# EAGLE design OSO-SWAT-A1-05-BLUE (EAGLE 9.6.2)
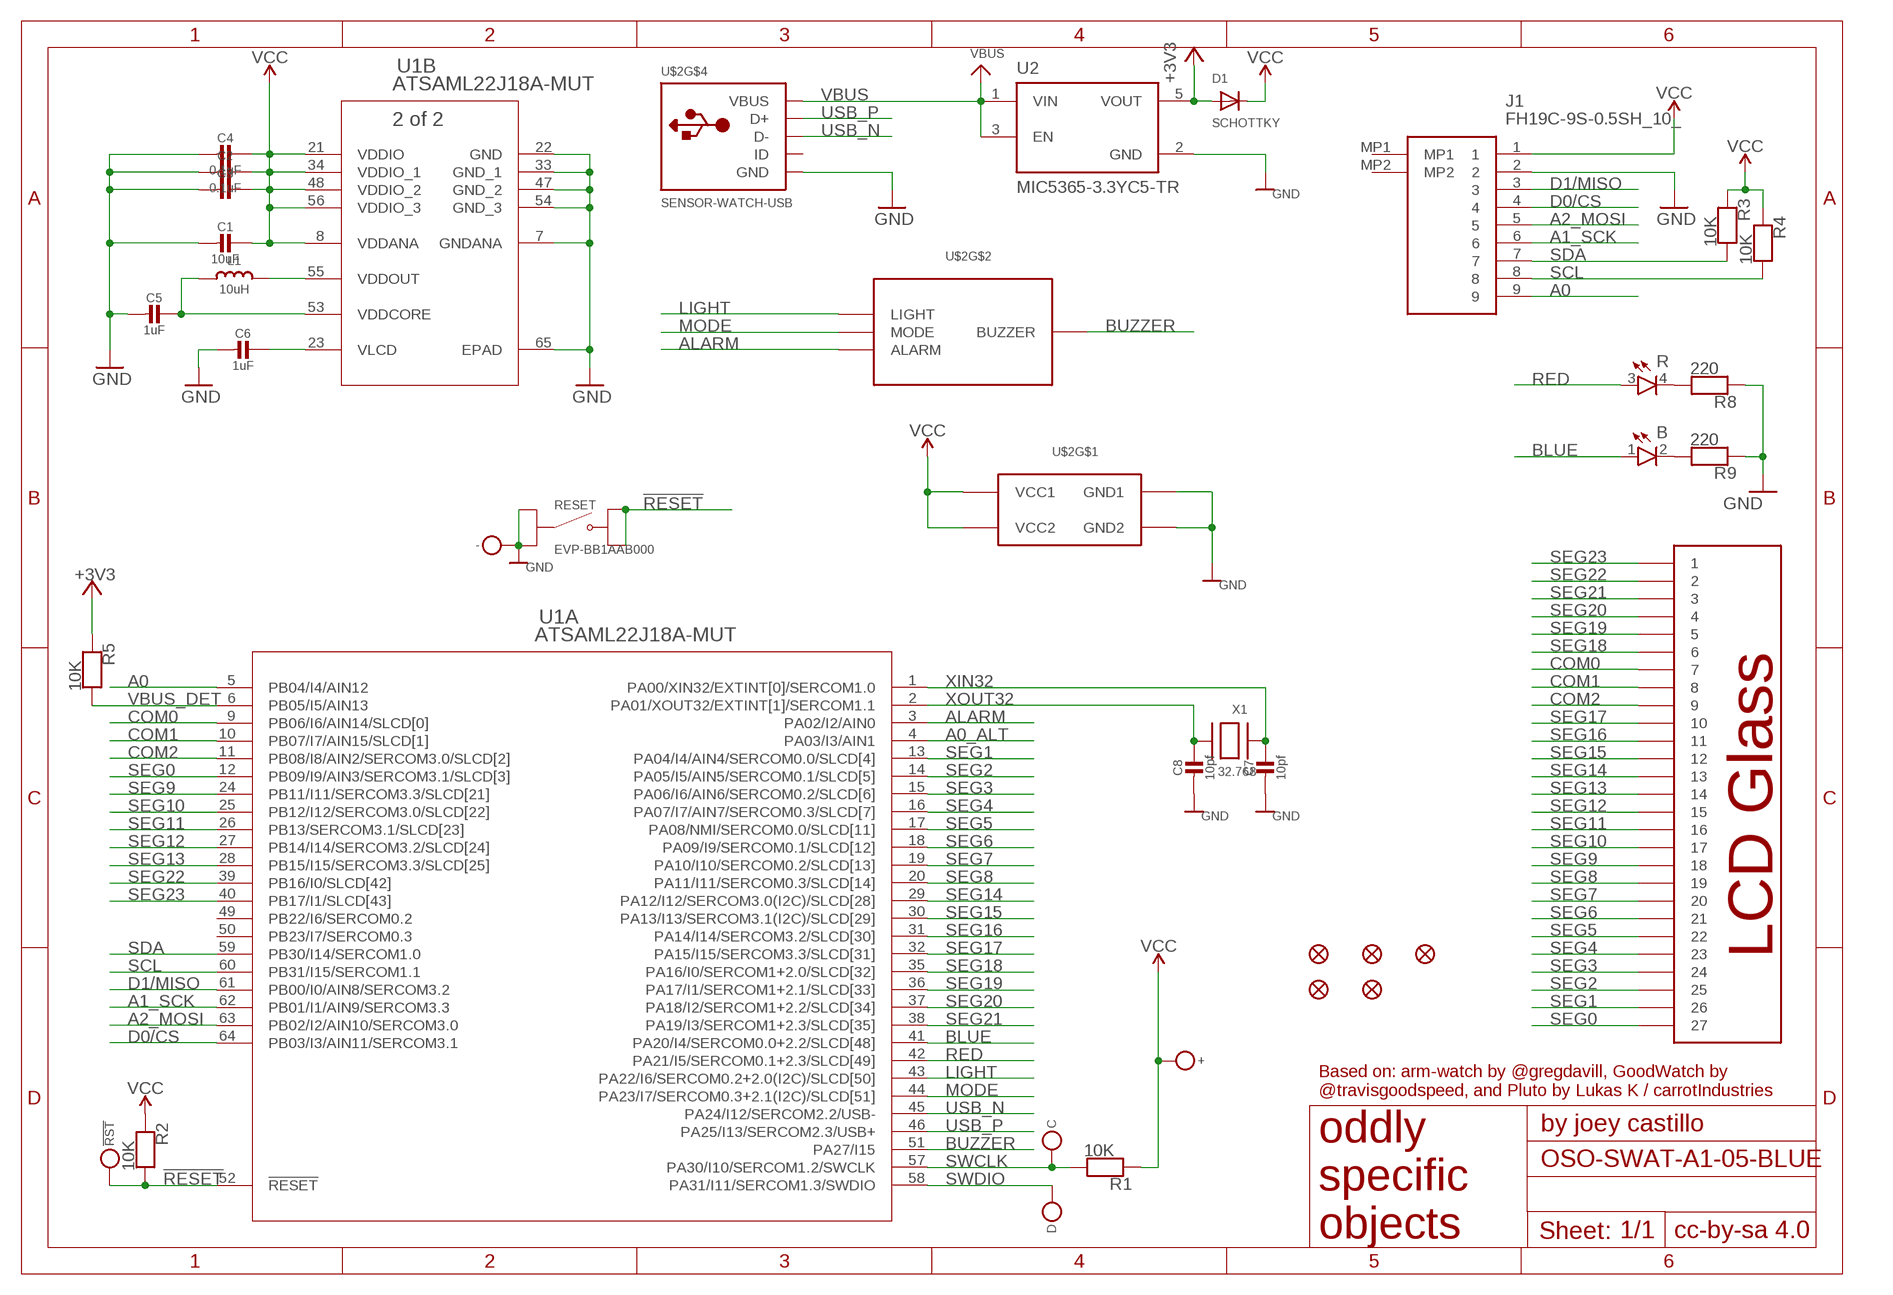
[diagram p0: schematic, sheet 1]

## Parts
!RST  MICROBUILDER_TESTPOINTROUND1.5MM  [MICROBUILDER_TESTPOINT_ROUND_1.5MM]
+  MICROBUILDER_TESTPOINTROUND1.5MM  [MICROBUILDER_TESTPOINT_ROUND_1.5MM]
-  MICROBUILDER_TESTPOINTROUND1.5MM  [MICROBUILDER_TESTPOINT_ROUND_1.5MM]
C  MICROBUILDER_TESTPOINTROUND1.5MM  [MICROBUILDER_TESTPOINT_ROUND_1.5MM]
C1  10uF  CAP_CERAMIC_0603MP  [_0603MP]
C2  0.1uF  CAP_CERAMIC_0603MP  [_0603MP]
C3  0.1uF  CAP_CERAMIC_0603MP  [_0603MP]
C4  0.1uF  CAP_CERAMIC_0603MP  [_0603MP]
C5  1uF  CAP_CERAMIC_0603MP  [_0603MP]
C6  1uF  CAP_CERAMIC_0603MP  [_0603MP]
C7  10pf  CAP_CERAMIC_0402MP  [_0402MP]
C8  10pf  CAP_CERAMIC_0402MP  [_0402MP]
D  MICROBUILDER_TESTPOINTROUND1.5MM  [MICROBUILDER_TESTPOINT_ROUND_1.5MM]
D1  SCHOTTKY  DIODESOD-323F  [SOD-323F]
FID1  FIDUCIAL_1MM  [FIDUCIAL_1MM]
FID2  FIDUCIAL_1MM  [FIDUCIAL_1MM]
FID3  FIDUCIAL_1MM  [FIDUCIAL_1MM]
FID4  FIDUCIAL_1MM  [FIDUCIAL_1MM]
FID6  FIDUCIAL_1MM  [FIDUCIAL_1MM]
J1  FH19C-9S-0.5SH_10_  [FH19C9S05SH10]
L1  10uH  MICROBUILDER_INDUCTOR_0805MP  [MICROBUILDER__0805MP]
LED  QBLP655-RIB  [LED_QBLP655]
R1  10K  RESISTOR_0603MP  [_0603MP]
R2  10K  RESISTOR_0603MP  [_0603MP]
R3  10K  RESISTOR_0603MP  [_0603MP]
R4  10K  RESISTOR_0603MP  [_0603MP]
R5  10K  RESISTOR_0603MP  [_0603MP]
R8  220  RESISTOR_0603MP  [_0603MP]
R9  220  RESISTOR_0603MP  [_0603MP]
RESET  EVP-BB1AAB000  [SW_EVP-BB1AAB000]
U1  ATSAML22J18A-MUT  [QFN64_9X9MC_MCH]
U2  MIC5365-3.3YC5-TR  [SOT65P210X110-5N]
U$2  SENSOR-WATCH-USB  [CASIO-F91W-OUTLINE-USB]
X1  32.768  XTAL-3.2X1.5  [XTAL3215]

## Nets
!RESET: !RST.P$1 R2.2 RESET.B1 RESET.B2 U1.52(A:!RESET)
+3V3: D1.A R5.1 U2.5(VOUT)
A0: J1.9 U1.5(A:PB04/I4/AIN12)
A0_ALT: U1.4(A:PA03/I3/AIN1)
A1_SCK: J1.6 U1.62(A:PB01/I1/AIN9/SERCOM3.3)
A2_MOSI: J1.5 U1.63(A:PB02/I2/AIN10/SERCOM3.0)
ALARM: U1.3(A:PA02/I2/AIN0) U$2.ALARM
BLUE: LED.1(A) U1.41(A:PA20/I4/SERCOM0.0+2.2/SLCD[48])
BUZZER: U1.51(A:PA27/I15) U$2.BUZZER
COM0: U1.9(A:PB06/I6/AIN14/SLCD[0]) U$2.7
COM1: U1.10(A:PB07/I7/AIN15/SLCD[1]) U$2.8
COM2: U1.11(A:PB08/I8/AIN2/SERCOM3.0/SLCD[2]) U$2.9
D0/CS: J1.4 U1.64(A:PB03/I3/AIN11/SERCOM3.1)
D1/MISO: J1.3 U1.61(A:PB00/I0/AIN8/SERCOM3.2)
GND [gnd]: -.P$1 C1.2 C2.2 C3.2 C4.2 C5.2 C6.2 C7.2 C8.2 J1.2 R8.1 R9.1 RESET.A1 RESET.A2 U1.7(B:GNDANA) U1.22(B:GND) U1.33(B:GND_1) U1.47(B:GND_2) U1.54(B:GND_3) U1.65(B:EPAD) U2.2(GND) U$2.GND U$2.GND1 U$2.GND2
LIGHT: U1.43(A:PA22/I6/SERCOM0.2+2.0(I2C)/SLCD[50]) U$2.LIGHT
MODE: U1.44(A:PA23/I7/SERCOM0.3+2.1(I2C)/SLCD[51]) U$2.MODE
N$1: LED.4(C) R8.2
N$2: LED.2(C) R9.2
RED: LED.3(A) U1.42(A:PA21/I5/SERCOM0.1+2.3/SLCD[49])
SCL: J1.8 R4.2 U1.60(A:PB31/I15/SERCOM1.1)
SDA: J1.7 R3.2 U1.59(A:PB30/I14/SERCOM1.0)
SEG0: U1.12(A:PB09/I9/AIN3/SERCOM3.1/SLCD[3]) U$2.27
SEG1: U1.13(A:PA04/I4/AIN4/SERCOM0.0/SLCD[4]) U$2.26
SEG2: U1.14(A:PA05/I5/AIN5/SERCOM0.1/SLCD[5]) U$2.25
SEG3: U1.15(A:PA06/I6/AIN6/SERCOM0.2/SLCD[6]) U$2.24
SEG4: U1.16(A:PA07/I7/AIN7/SERCOM0.3/SLCD[7]) U$2.23
SEG5: U1.17(A:PA08/NMI/SERCOM0.0/SLCD[11]) U$2.22
SEG6: U1.18(A:PA09/I9/SERCOM0.1/SLCD[12]) U$2.21
SEG7: U1.19(A:PA10/I10/SERCOM0.2/SLCD[13]) U$2.20
SEG8: U1.20(A:PA11/I11/SERCOM0.3/SLCD[14]) U$2.19
SEG9: U1.24(A:PB11/I11/SERCOM3.3/SLCD[21]) U$2.18
SEG10: U1.25(A:PB12/I12/SERCOM3.0/SLCD[22]) U$2.17
SEG11: U1.26(A:PB13/SERCOM3.1/SLCD[23]) U$2.16
SEG12: U1.27(A:PB14/I14/SERCOM3.2/SLCD[24]) U$2.15
SEG13: U1.28(A:PB15/I15/SERCOM3.3/SLCD[25]) U$2.14
SEG14: U1.29(A:PA12/I12/SERCOM3.0(I2C)/SLCD[28]) U$2.13
SEG15: U1.30(A:PA13/I13/SERCOM3.1(I2C)/SLCD[29]) U$2.12
SEG16: U1.31(A:PA14/I14/SERCOM3.2/SLCD[30]) U$2.11
SEG17: U1.32(A:PA15/I15/SERCOM3.3/SLCD[31]) U$2.10
SEG18: U1.35(A:PA16/I0/SERCOM1+2.0/SLCD[32]) U$2.6
SEG19: U1.36(A:PA17/I1/SERCOM1+2.1/SLCD[33]) U$2.5
SEG20: U1.37(A:PA18/I2/SERCOM1+2.2/SLCD[34]) U$2.4
SEG21: U1.38(A:PA19/I3/SERCOM1+2.3/SLCD[35]) U$2.3
SEG22: U1.39(A:PB16/I0/SLCD[42]) U$2.2
SEG23: U1.40(A:PB17/I1/SLCD[43]) U$2.1
SWCLK: C.P$1 R1.2 U1.57(A:PA30/I10/SERCOM1.2/SWCLK)
SWDIO: D.P$1 U1.58(A:PA31/I11/SERCOM1.3/SWDIO)
USB_N: U1.45(A:PA24/I12/SERCOM2.2/USB-) U$2.USB_N(D-)
USB_P: U1.46(A:PA25/I13/SERCOM2.3/USB+) U$2.USB_P(D+)
VBUS: U2.1(VIN) U2.3(EN) U$2.VBUS
VBUS_DET: R5.2 U1.6(A:PB05/I5/AIN13)
VCC [power]: +.P$1 C1.1 C2.1 C3.1 C4.1 D1.C J1.1 R1.1 R2.1 R3.1 R4.1 U1.8(B:VDDANA) U1.21(B:VDDIO) U1.34(B:VDDIO_1) U1.48(B:VDDIO_2) U1.56(B:VDDIO_3) U$2.VCC1 U$2.VCC2
VDDCORE: C5.1 L1.1 U1.53(B:VDDCORE)
VDDOUT: L1.2 U1.55(B:VDDOUT)
VLCD: C6.1 U1.23(B:VLCD)
XIN32: C7.1 U1.1(A:PA00/XIN32/EXTINT[0]/SERCOM1.0) X1.P$1
XOUT32: C8.1 U1.2(A:PA01/XOUT32/EXTINT[1]/SERCOM1.1) X1.P$2
Unconnected: J1.MP1 J1.MP2 U1.49(A:PB22/I6/SERCOM0.2) U1.50(A:PB23/I7/SERCOM0.3) U$2.USB_ID(ID)

## Notes on the sheet
- Based on: arm-watch by @gregdavill, GoodWatch by 
  @travisgoodspeed, and Pluto by Lukas K / carrotIndustries

## Library data of the parts
!RST + - C D = Adafruit Feather M0 Express:MICROBUILDER_TESTPOINT: Test Point Various test points for characterisation and PCB testing TESTPOINT_SMT - Compact Surface Mount Test Point [Digikey: 5016KTR-ND]
C1-C8 = microbuilder:CAP_CERAMIC: Ceramic Capacitors For new designs, use the packages preceded by an '_' character since they are more reliable: The following footprints should be used on most boards: _0402 - Standard footprint for regular board layouts _0603 - Standard footprint for regular board layouts _0805 - Standard footprint for regular board layouts _1206 - Standard footprint for regular board layouts For extremely tight-pitch boards where space is at a premium, the following 'micro-pitch' footprints can be used (smaller pads, no silkscreen outline, etc.): _0402MP - Micro-pitch footprint for very dense/compact boards _0603MP - Micro-pitch footprint for very dense/compact boards _0805MP - Micro-pitch footprint for very dense/compact boards _1206MP - Micro-pitch footprint for very dense/compact boards
D1 = adafruit:DIODE: Diode SMADIODE - SMA Surface Mount Package 20V 1A Schottky Diode Digikey: 641-1014-6-ND DO-1N4148 - Through Hole Small Current Diode SOD-123 20V 1 A (.5mV Vf) Schottky Diode - Digikey: MBRX120TPMSCT-ND SOD-323 10V 570mA (.38mV Vf, 3ns) Schottky Diode - Digikey: ZLLS410CT-ND SOD-523 30V 30mA Schottky Diode (RB751S-40TE61) - Digikey: RB751S-40TE61CT-ND SOT23-R/W - SOT23 Package (R = Solder Paste/Reflow Ovens, W = Hand-Soldering) BAT54Film 40V 300mA - Digikey: 497-7162-1-ND
FID1 FID2 FID4 = microbuilder:FIDUCIAL: Fiducial Alignment Points Various fiducial points for machine vision alignment.; BOM: EXCLUDE
FID3 FID6 = microbuilder:FIDUCIAL: Fiducial Alignment Points Various fiducial points for machine vision alignment.; BOM: EXCLUDE; REV: A
J1 = FH19C-9S-0.5SH:FH19C-9S-0.5SH_10_: CONN FFC BOTTOM 9POS 0.50MM R/A Source: Datasheet <https://componentsearchengine.com/Datasheets/1/FH19C-9S-0.5SH(10).pdf>; DESCRIPTION: CONN FFC BOTTOM 9POS 0.50MM R/A; HEIGHT: 1mm; MANUFACTURER_NAME: Hirose; MANUFACTURER_PART_NUMBER: FH19C-9S-0.5SH(10); MOUSER_PART_NUMBER: 798-FH19C9S05SH10; MOUSER_PRICE-STOCK: https://www.mouser.co.uk/ProductDetail/Hirose-Connector/FH19C-9S-05SH10?qs=vnk2wBG9e15bX8eK%2FvDSMA%3D%3D
L1 = Adafruit 3.5in 480x320 FeatherWing:MICROBUILDER_INDUCTOR: Inductors 0603: 10nH Ceramic Inductor - microwire antenna/RF (Digikey: 712-1434-2-ND) 0805: 560nH Ceramic Inductor - RF (Digikey: 553-1047-1-ND) 270nH Ceramic Inductor - Q = 40@250MHz, +-5%, 1 Ohm DC Resistance (Digikey: 535-10506-2-ND) 1007 (2518 Metric) SMT: 10µH 10% 250mOhm 820mA 1007 Inductor (Digikey: 587-2189-1-ND) 22µH 10% 500mOhm 580mA 1007 Inductor (Digikey: 587-2190-1-ND) 47µH 10% 950mOhm 420mA 1007 Inductor (Digikey: 587-2191-1-ND) 47µH 5% 100mOhm 1A 1008 Inductor (Digikey: 732-1816-1-ND) 5.0x5.0mm (Taiyo Yuden NR5040 Series) 6.8µH 20% 2.3A 64mOhm Inductor (Digikey: 587-2374-2-ND) 5.0x5.0mm (TDK VLC5045 Series) 4.7µH 20% 3.3A 34mOhm Inductor (Digikey: 445-6526-1-ND) 6.8µH 20% 2.7A 46mOhm Inductor (Digikey: 445-6527-1-ND) 6.0x6.0mm (TDK VLC6045 Series) 4.7µH 20% 3.8A 27mOhm Inductor (Digikey: 445-6538-2-ND) 6.8µH 20% 3A 41mOhm Inductor (Digikey: 445-6540-1-ND) 6.2µH 30% 2.2A 45mOhm Inductor (Digikey: SRR5028-6R2YCT-ND) - Not TDK VLC6045 but footprint should match 6.0x6.0mm (TDK SLF6045 Series) 6.8uH 30% 2A 33mOhm Inductor (Digikey: 445-4572-1-ND, Mouser: 810-SLF645T6R8N2R0PF) 6.0x6.0mm (Sumida CDRH5D28 Series) 6.2uH 30% 1.8A 45mOhm Inductor (Digikey: 308-1542-1-ND) Taiyo Yuden NR3015T2R2M - 2.2uH 20% 1.5A (Digikey: 587-1648-2-ND, Mouser: 963-NR3015T2R2M) - Used with TI TPS62172 CoilCraft RFID Transponder Coil - MA5532-AE (For use with AS3935 Lightning Sensor) Taiyo Yuden NRH2412T2R2MNGH - 2.2uH 20% 1AA (Digikey: 587-3443-1-ND) - Used with TI LM3671 Vishay IHLP 1.0uH Molded Inductor - 24mOhm DCR, 5A, +/-20%, -55°C-125°C (Digikey: 541-1319-1-ND)
LED = QBLP655:QBLP655-RIB: Blue, Red 470nm Blue, 623nm Red LED Indication - Discrete 3.1V Blue, 2V Red 4-SMD; DESCRIPTION: Green, Red 571nm Green, 631nm Red LED Indication - Discrete 2V Green, 2V Red 1206 (3216 Metric); DIGI-KEY_PART_NUMBER: 160-2026-1-ND; MF: Lite-On Inc.; MP: LTST-C235KGKRKT; PACKAGE: 1206 Lite-On; PURCHASE-URL: https://pricing.snapeda.com/search/part/LTST-C235KGKRKT/?ref=eda
R1-R5 R8 R9 = microbuilder:RESISTOR: Resistors For new designs, use the packages preceded by an '_' character since they are more reliable: The following footprints should be used on most boards: _0402 - Standard footprint for regular board layouts _0603 - Standard footprint for regular board layouts _0805 - Standard footprint for regular board layouts _1206 - Standard footprint for regular board layouts For extremely tight-pitch boards where space is at a premium, the following 'micro-pitch' footprints can be used (smaller pads, no silkscreen outline, etc.): _0402MP - Micro-pitch footprint for very dense/compact boards _0603MP - Micro-pitch footprint for very dense/compact boards _0805MP - Micro-pitch footprint for very dense/compact boards _1206MP - Micro-pitch footprint for very dense/compact boards
RESET = EVP-BB1AAB000:EVP-BB1AAB000: SWITCH TACTILE SPST-NO 0.02A 15V; DESCRIPTION: Tactile Switch SPST-NO Top Actuated Surface Mount; DIGI-KEY_PART_NUMBER: P124390CT-ND; MF: Panasonic Electronic Components; MP: EVP-BB1AAB000; PACKAGE: None; PURCHASE-URL: https://pricing.snapeda.com/search/part/EVP-BB1AAB000/?ref=eda
U1 = ATSAML22:ATSAML22J18A-MUT; BUILT_BY: EMA_Molly; COPYRIGHT: Copyright (C) 2018 Accelerated Designs. All rights reserved; MANUFACTURER_PART_NUMBER: ATSAML22J18A-MUT; SOURCELIBRARY: Microchip_2019-08-23_25; VENDOR: Microchip
U2 = MIC5365-3.3YC5-TR:MIC5365-3.3YC5-TR: Linear Voltage Regulator IC 1 Output 150mA SC-70-5; DESCRIPTION: Linear Voltage Regulator IC 1 Output 150mA SC-70-5; DIGI-KEY_PART_NUMBER: 576-3193-1-ND; MF: Microchip; MP: MIC5365-3.3YC5-TR; PACKAGE: SC-70-5 Microchip; PURCHASE-URL: https://pricing.snapeda.com/search/part/MIC5365-3.3YC5-TR/?ref=eda
U$2 = My Stuff:SENSOR-WATCH-USB
X1 = adafruit:XTAL: Low cost SMT crystals, no capacitors included http://www.ladyada.net/library/eagle

## Net classes
0 default: width 0.102 mm
1 power: width 0.254 mm
2 gnd: width 0.254 mm

## Board
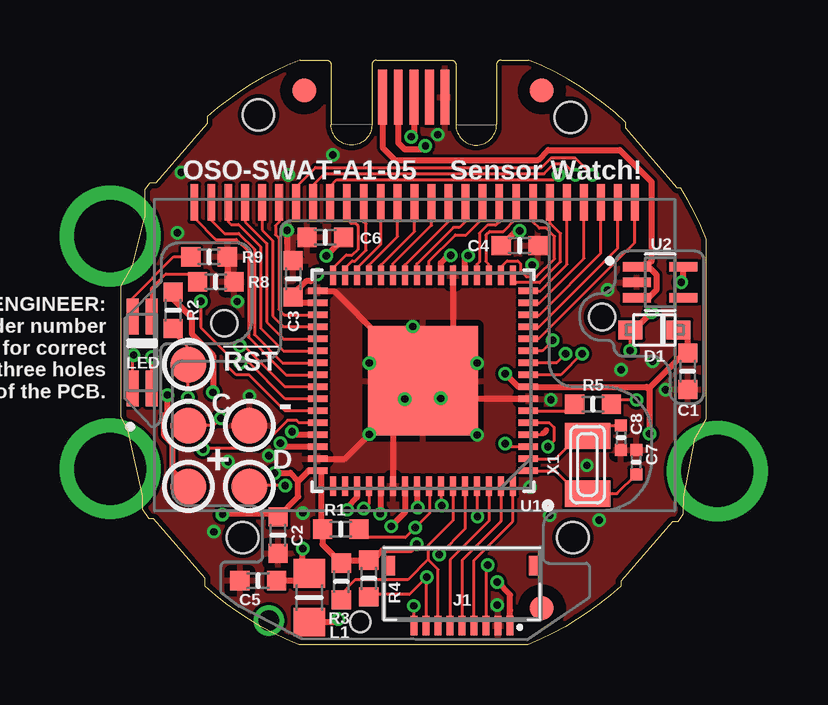
[diagram p1: board, top side]
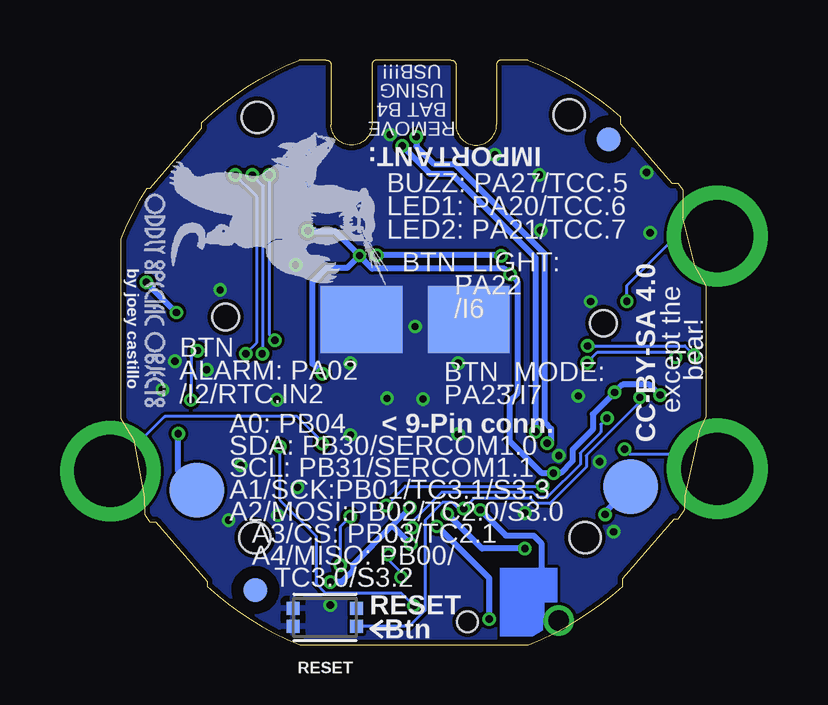
[diagram p2: board, bottom side, seen from below]

Size 24.4 x 24.38 mm. Coordinates in mm from the lower left corner, seen from the top.
Copper layers (1*16): Top 0.035559375mm / dielectric 1.6mm / Bottom 0.035559375mm
Design rules "jlcpcb2layer *": minimum track width 5mil, minimum drill 12mil, track to track 5mil, track to pad 5mil, pad to pad 5mil, via to via 5mil, smd to smd 5mil, copper to edge 8mil, drill to drill 6mil, minimum pad ring 5mil, minimum via ring 5mil, stop-mask expansion 2.5mil, vias tented up to drill 12mil, thermal gap 10mil

### Footprints (pad centres in the part's own frame; a part is rotated, then mirrored left to right if it is on the bottom)
MICROBUILDER_TESTPOINT_ROUND_1.5MM = smd 1.5 x 1.5: P$1 0,0
_0603MP = smd 0.8 x 0.8: 1 -0.762,0; 2 0.762,0
_0402MP = smd 0.5 x 0.5: 1 -0.508,0; 2 0.508,0
SOD-323F = smd 1 x 0.8: A -1,0; C 1,0
FIDUCIAL_1MM = smd 1 x 1: 1 0,0
FH19C9S05SH10 = smd 0.3 x 0.8: 1 -2,2.5; 2 -1.5,2.5; 3 -1,2.5; 4 -0.5,2.5; 5 0,2.5; 6 0.5,2.5; 7 1,2.5; 8 1.5,2.5; 9 2,2.5 | smd 0.4 x 0.8: MP1 -3,0; MP2 3,0
MICROBUILDER__0805MP = smd 1.2 x 1.3: 1 -1.016,0; 2 1.016,0
LED_QBLP655 = smd 1.5 x 0.5: 1 -1.5,0.4; 2 1.5,0.4; 3 -1.5,-0.4; 4 1.5,-0.4
SW_EVP-BB1AAB000 = smd 0.55 x 0.55: A1 -1.325,0.375; A2 -1.325,-0.375; B1 1.325,0.375; B2 1.325,-0.375
QFN64_9X9MC_MCH = smd 0.813 x 0.254: 1 -4.394,3.75; 2 -4.394,3.25; 3 -4.394,2.75; 4 -4.394,2.25; 5 -4.394,1.75; 6 -4.394,1.25; 7 -4.394,0.75; 8 -4.394,0.25; 9 -4.394,-0.25; 10 -4.394,-0.75; 11 -4.394,-1.25; 12 -4.394,-1.75; 13 -4.394,-2.25; 14 -4.394,-2.75; 15 -4.394,-3.25; 16 -4.394,-3.75; 33 4.394,-3.75; 34 4.394,-3.25; 35 4.394,-2.75; 36 4.394,-2.25; 37 4.394,-1.75; 38 4.394,-1.25; 39 4.394,-0.75; 40 4.394,-0.25; 41 4.394,0.25; 42 4.394,0.75; 43 4.394,1.25; 44 4.394,1.75; 45 4.394,2.25; 46 4.394,2.75; 47 4.394,3.25; 48 4.394,3.75 | smd 0.254 x 0.813: 17 -3.75,-4.394; 18 -3.25,-4.394; 19 -2.75,-4.394; 20 -2.25,-4.394; 21 -1.75,-4.394; 22 -1.25,-4.394; 23 -0.75,-4.394; 24 -0.25,-4.394; 25 0.25,-4.394; 26 0.75,-4.394; 27 1.25,-4.394; 28 1.75,-4.394; 29 2.25,-4.394; 30 2.75,-4.394; 31 3.25,-4.394; 32 3.75,-4.394; 49 3.75,4.394; 50 3.25,4.394; 51 2.75,4.394; 52 2.25,4.394; 53 1.75,4.394; 54 1.25,4.394; 55 0.75,4.394; 56 0.25,4.394; 57 -0.25,4.394; 58 -0.75,4.394; 59 -1.25,4.394; 60 -1.75,4.394; 61 -2.25,4.394; 62 -2.75,4.394; 63 -3.25,4.394; 64 -3.75,4.394 | smd 4.572 x 4.572: 65 0,0
SOT65P210X110-5N = smd 1.17 x 0.4: 1 -0.97,0.65; 2 -0.97,0; 3 -0.97,-0.65; 4 0.97,-0.65; 5 0.97,0.65
CASIO-F91W-OUTLINE-USB = smd 0.326 x 1.52: 1 -9.148,6.25; 2 -8.442,6.25; 3 -7.736,6.25; 4 -7.03,6.25; 5 -6.324,6.25; 6 -5.618,6.25; 7 -4.912,6.25; 8 -4.206,6.25; 9 -3.5,6.25; 10 -2.794,6.25; 11 -2.088,6.25; 12 -1.382,6.25; 13 -0.676,6.25; 14 0.03,6.25; 15 0.736,6.25; 16 1.442,6.25; 17 2.148,6.25; 18 2.854,6.25; 19 3.56,6.25; 20 4.266,6.25; 21 4.972,6.25; 22 5.678,6.25; 23 6.384,6.25; 24 7.09,6.25; 25 7.796,6.25; 26 8.502,6.25; 27 9.208,6.25 | drill 3 pad 4.2: ALARM 12.654,-4.95; LIGHT -12.654,4.85; MODE -12.654,-4.85 | drill 0.85 pad 1.2: BUZZER -6.045,-11.176 | smd 0.37 x 2.3: GND 1.3,10.644; USB_ID 0.65,10.644; USB_N -0.65,10.644; USB_P 0,10.644; VBUS -1.3,10.644 | smd 3.404 x 2.794 bottom: GND1 -2.286,1.372; GND2 2.184,1.372 | smd 2.286 x 2.286 bottom: VCC1 -9.042,-5.588; VCC2 9.042,-5.74 | hole 0.85: -2.235,-11.227 | hole 1.1: -7.899,1.219; 7.849,1.473 | hole 1.3: -6.477,9.906; 6.528,9.804; 6.629,-7.722; -7.137,-7.722
XTAL3215 = smd 1.1 x 1.9: P$1 1.2,0; P$2 -1.2,0

### Placement (x,y rotation side)
!RST  2.8,11.68 0 top
+  2.8,6.6 0 top
-  5.34,9.14 0 top
C  2.8,9.14 0 top
C1  23.62,11.4 270 top
C2  6.54,4.57 270 top
C3  7.17,15.26 90 top
C4  16.61,16.64 0 top
C5  5.71,2.67 180 top
C6  8.51,16.99 180 top
C7  21.47,7.61 90 top
C8  20.84,8.63 270 top
D  5.34,6.6 0 top
D1  22.23,13.13 0 top
FID1  7.63,23.11 0 top
FID2  17.53,23.11 0 top
FID3  17.53,1.52 0 top
FID4  4.07,21.08 0 bottom
FID6  18.8,2.28 0 bottom
J1  14.21,3.3 180 top
L1  7.84,1.96 270 top
LED  0.87,12.19 90 top
R1  9.15,4.82 0 top
R2  2.17,13.94 270 top
R3  9.18,2.64 270 top
R4  10.32,2.76 270 top
R5  19.67,10.03 180 top
R8  3.94,15.13 180 top
R9  3.67,16.17 180 top
RESET  15.91,1.14 0 bottom
U1  12.58,11 180 top
U2  22.46,15.11 0 top
U$2  12.2,12.19 0 top
U$5  [OSO_BEAR_250X360MIL_1000DPI]  17.79,18.15 270 bottom
U$6  [OSO_WORDMARK_ONELINE_350MIL_1000DPI]  22.99,14.34 270 bottom
X1  19.44,7.5 270 top

### Tracks (layer width: path | path; a pad name or v marks a point on that pad's centre or on a via)
!RESET  (via drill 0.3)
  Top 0.127: R2.2 2.17,13 2.8,12.36 !RST.P$1 2.78,11.65 v2.78,10.31 | U1.52 10.33,5.88 v10.12,5.67
  Bottom 0.127: v2.78,10.31 2.78,10.12 5.01,7.89 5.01,7.41 6.54,5.88 7.12,5.88 7.33,6.09 9.69,6.09 v10.12,5.67 10.35,5.67 10.61,5.92 11,5.92 11.73,5.19 11.73,1.42 12.39,0.76 RESET.B2 RESET.B1
+3V3  (via drill 0.3)
  Top 0.127: v21.22,12.26 21.22,13.11 D1.A | v21.49,10.2 20.61,10.2 R5.1
  Top 0.254: D1.A 21.38,13.13 v22.11,13.85 | v23.35,15.11 23.43,15.19 U2.5
  Bottom 0.127: v21.22,12.26 21.49,11.99 v21.49,10.2
  Bottom 0.254: v22.11,13.85 v23.35,15.09 v23.35,15.11
A0  (via drill 0.3)
  Top 0.127: J1.9 12.21,1.61 v12.2,1.62 | v17.79,8.25 18.04,8.5 18.04,9.06 17.85,9.25 U1.5
  Bottom 0.127: v12.2,1.62 12.72,2.14 15.88,2.14 16.27,2.53 16.27,4.52 17.79,6.04 v17.79,8.25
A0_ALT
  Top 0.127: 17.6,8.82 17.6,8.75 U1.4
  Top 0.254: 17.72,8.93 17.6,8.82
A1_SCK
  Top 0.127: J1.6 13.71,3.53 15.33,5.16 U1.62
A2_MOSI
  Top 0.127: J1.5 14.21,3.52 15.83,5.15 U1.63
ALARM  (via drill 0.3)
  Top 0.127: U1.3 16.13,8.25 v16.01,8.38
  Bottom 0.127: U$2.ALARM 22.58,9.51 17.06,9.51 16.01,8.45 v16.01,8.38
BLUE  (via drill 0.3)
  Top 0.127: U1.41 6.83,10.75 5.13,12.46 v4.95,12.46 | LED.1 0.47,12.03 v0.52,12.08
  Bottom 0.127: v0.52,12.08 0.9,12.46 v4.95,12.46
BUZZER  (via drill 0.3)
  Top 0.254: U1.51 9.83,6.13 9.43,5.73 v9.43,5.62
  Bottom 0.254: v9.43,5.62 8.36,4.55 7.21,4.55 6.88,4.23 6.88,1.01 U$2.BUZZER
COM0  (via drill 0.3)
  Top 0.127: U$2.7 7.29,19.08 8.1,19.89 17.52,19.89 17.93,20.3 18.92,20.3 v19.64,19.58 | v19.21,12.13 18.33,11.25 U1.9
  Bottom 0.127: v19.21,12.13 18.74,12.61 18.74,18.68 v19.64,19.58
COM1  (via drill 0.3)
  Top 0.127: U$2.8 7.99,19.16 8.48,19.64 17.63,19.64 18.04,20.05 18.47,20.05 v18.94,19.58 | v18.52,12.13 18.14,11.75 U1.10
  Bottom 0.127: v18.52,12.13 18.48,12.17 18.48,19.13 v18.94,19.58
COM2  (via drill 0.3)
  Top 0.127: U$2.9 8.7,19.1 8.99,19.39 18.04,19.39 v18.23,19.58 | v17.99,12.69 17.55,12.25 U1.11
  Bottom 0.127: v18.23,19.58 18.23,12.93 v17.99,12.69
D0/CS
  Top 0.127: J1.4 14.71,3.52 16.33,5.14 U1.64
D1/MISO  (via drill 0.3)
  Top 0.127: U1.61 14.83,5.36 v14.85,5.34 | v15.27,3.32 15.21,3.25 J1.3
  Bottom 0.127: v14.85,5.34 15.27,4.92 v15.27,3.32
GND  (via drill 0.3)
  Top 0.254: U1.54 11.33,9.75 v10.35,8.77 9.33,7.75 U1.47 | U1.33 8.58,14.75 8.6,14.74 8.88,14.74 10.85,12.77 10.85,12.25 v10.35,11.74 | U1.22 13.83,12.75 v14.84,11.74 | U1.7 13.33,10.25 v13.32,10.27 U1.65 | v6.92,17.28 6.92,16.27 C3.2 | R9.1 4.43,15.41 R8.1
  other vias: 14.84,8.74 12.15,13.27 11.82,10.24 17.13,15.83 13.19,21.27 15.68,1.66 4.83,14.31 20.28,14.79 20.84,11.46 22.16,11.82 17.86,5.39 22.69,10.62 3.87,4.71 17.05,6.56 7.58,5.49 8.82,20.43 2.34,17.18 6.97,19.59 2.5,19.69 6.15,7.88 5.34,10.37 4.45,7.63 19.41,7.47 19.92,5.19 17.91,10.22
  pour Top: 7.37,24.38 17.03,24.38 19.57,23.11 21.09,21.84 23.38,19.04 24.39,17.01 24.39,9.39 23.38,5.33 20.84,2.28 18.3,0.5 17.03,-0.01 7.37,-0.01 5.09,1.01 3.56,2.28 1.02,5.33 0.01,9.39 0.01,14.98 1.02,19.04 3.56,22.09 5.85,23.62
  pour Bottom: 17.03,24.38 14.87,24.38 14.87,24.25 9.53,24.25 9.53,24.38 7.37,24.38 4.83,23.11 3.31,21.84 1.02,19.04 0.01,17.01 0.01,9.01 0.9,5.45 3.51,2.32 6.1,0.5 7.37,-0.01 17.03,-0.01 19.31,1.01 20.84,2.28 23.38,5.33 24.39,9.39 24.39,17.82 20.84,22.09 18.55,23.62
LIGHT  (via drill 0.3)
  Top 0.127: U1.43 6.82,9.75 5.32,11.25 4.79,11.25 4.47,11.58 4.47,12.08 3.32,13.23 v3.32,14.32
  Bottom 0.127: v3.32,14.32 3.32,14.97 1.25,17.04 U$2.LIGHT
MODE  (via drill 0.3)
  Top 0.127: U1.44 7.41,9.25 7.31,9.35 6.92,9.35 5.74,8.17 3.44,8.17 v3.41,8.15
  Bottom 0.127: v3.41,8.15 3.21,7.94 0.39,7.94 U$2.MODE
N$1
  Top 0.127: LED.4 1.27,14.87 1.86,15.46 2.85,15.46 R8.2
N$2
  Top 0.127: LED.2 0.47,14.45 2.19,16.17 R9.2
RED  (via drill 0.3)
  Top 0.127: U1.42 6.83,10.25 5.33,11.76 v4.97,11.76 | LED.3 v1.27,11.98 v1.28,11.98
  Bottom 0.127: v4.97,11.76 4.54,12.19 1.49,12.19 v1.28,11.98
SCL  (via drill 0.3)
  Top 0.127: R4.2 10.41,2.09 12.01,2.09 v12.74,2.81 12.74,0.83 J1.8 | U1.60 14.33,4.82 v13.26,3.75
  Bottom 0.127: v13.26,3.75 13.26,3.54 12.74,3.02 v12.74,2.81
SDA
  Top 0.127: R3.2 9.18,2.13 9.75,2.71 11.95,2.71 12.79,3.55 | U1.59 13.83,5.18 12.79,4.14 12.79,3.55 | 12.79,3.55 13.21,3.13 J1.7
SEG0
  Top 0.127: U$2.27 21.41,16.77 17.39,12.75 U1.12
SEG1
  Top 0.127: U1.13 17.42,13.25 20.7,16.54 U$2.26
SEG2
  Top 0.127: U1.14 17.43,13.75 20,16.32 U$2.25
SEG3
  Top 0.127: U1.15 17.44,14.25 19.29,16.1 U$2.24
SEG4
  Top 0.127: U1.16 17.48,14.75 18.58,15.86 U$2.23
SEG5
  Top 0.127: U1.17 16.33,15.22 16.46,15.09 17.45,15.09 18.31,15.96 18.31,17.15 17.88,17.58 U$2.22
SEG6
  Top 0.127: U1.18 15.83,15.74 16.09,16 16.54,16 16.65,15.88 16.65,15.59 16.89,15.35 17.32,15.35 18.06,16.09 18.06,17.02 17.72,17.36 17.43,17.36 17.17,17.62 U$2.21
SEG7
  Top 0.127: U1.19 15.33,15.86 15.2,15.98 15.2,17.07 15.37,17.23 15.93,17.23 16.47,17.77 U$2.20
SEG8
  Top 0.127: U$2.19 15.76,17.65 15.6,17.49 15.26,17.49 14.93,17.16 14.93,15.96 14.83,15.86 U1.20
SEG9
  Top 0.127: U1.24 12.83,15.99 13.93,17.09 14.38,17.09 15.05,17.77 U$2.18
SEG10
  Top 0.127: U1.25 12.33,15.87 13.85,17.39 14.09,17.39 14.35,17.65 U$2.17
SEG11
  Top 0.127: U1.26 11.83,15.83 13.64,17.64 U$2.16
SEG12
  Top 0.127: U1.27 11.33,15.89 12.94,17.49 U$2.15
SEG13
  Top 0.127: U1.28 10.83,15.83 12.23,17.23 U$2.14
SEG14
  Top 0.127: U1.29 10.33,15.83 11.52,17.02 U$2.13
SEG15
  Top 0.127: U1.30 9.83,15.7 10.82,16.69 U$2.12
SEG16
  Top 0.127: U$2.11 10.11,17.65 10.21,17.55 10.21,16.45 9.75,16 9.62,16 9.33,15.7 U1.31
SEG17
  Top 0.127: U$2.10 9.41,17.75 9.58,17.58 9.75,17.58 9.86,17.46 9.86,16.48 9.63,16.25 9.38,16.25 8.83,15.7 U1.32
SEG18
  Top 0.127: U1.35 6.8,13.75 6.57,13.98 6.57,16.95 6.43,17.09 6.43,17.47 6.58,17.62 U$2.6
SEG19
  Top 0.127: U$2.5 5.88,17.29 6.32,16.84 6.32,13.71 6.77,13.25 U1.36
SEG20
  Top 0.127: U$2.4 5.17,17.62 6.07,16.73 6.07,13.46 6.77,12.75 U1.37
SEG21
  Top 0.127: U1.38 6.76,12.25 5.81,13.2 5.81,16.6 4.89,17.52 4.58,17.52 4.46,17.64 U$2.3
SEG22
  Top 0.127: U1.39 6.73,11.75 5.56,12.92 5.56,16.49 4.9,17.15 4.3,17.15 3.76,17.7 U$2.2
SEG23
  Top 0.127: U1.40 6.87,11.25 5.3,12.82 5.3,16.39 4.79,16.9 3.94,16.9 3.05,17.79 U$2.1
SWCLK  (via drill 0.3)
  Top 0.127: R1.2 10.27,4.46 11.84,4.46 v12.26,4.88 12.86,5.48 12.86,6.58 U1.57 | v4.15,9.44 3.84,9.14 C.P$1
  Bottom 0.127: v12.26,4.88 12.26,5.14 11.06,6.34 7.23,6.34 7.02,6.14 6.64,6.14 5.27,7.51 5.27,7.99 4.4,8.86 4.4,9.19 v4.15,9.44
SWDIO  (via drill 0.3)
  Top 0.127: U1.58 13.33,5.82 v13.36,5.8 | v6.83,6.63 5.37,6.63 D.P$1
  Bottom 0.127: v13.36,5.8 12.55,6.6 6.86,6.6 v6.83,6.63
USB_N  (via drill 0.3)
  Top 0.254: U1.45 7.25,8.75 v7.12,8.88 | U$2.USB_N 11.55,20.93 11.54,20.93 11.82,20.65 12.53,20.65 v12.68,20.8
  Bottom 0.254: v7.12,8.88 7.12,16.12 10.63,19.63 11.52,19.63 v12.68,20.8
USB_P  (via drill 0.3)
  Top 0.254: U1.46 6.78,8.25 v6.63,8.4 | U$2.USB_P 12.2,21.28 v12.1,21.18
  Bottom 0.254: v6.63,8.4 6.48,8.4 6.48,9 6.74,9.26 6.74,16.28 10.49,20.04 11.36,20.04 12.1,20.77 v12.1,21.18
VBUS
  Top 0.254: U$2.VBUS 10.9,20.72 11.41,20.21 17.39,20.21 17.8,20.62 20.78,20.62 22.11,19.3 22.11,15.99 21.92,15.8 | 21.92,15.8 21.87,15.75 U2.1 | U2.3 21.99,14.46 22.33,14.8 22.33,15.41 21.94,15.8 21.92,15.8
VBUS_DET
  Top 0.127: U1.6 17,9.73 18.61,9.73 R5.2
VCC  (via drill 0.3)
  Top 0.254: U1.21 14.33,16.09 v14.46,16.22 | 21.98,10.67 21.9,10.75 U1.8 16.55,10.75 v16.01,11.3 | D1.C 23.62,12.74 C1.1 23.47,12.16 21.98,10.67 | U1.56 12.33,5.74 v12.36,5.71 | U1.34 7.41,14.25 C3.1 7.17,14.63 7.7,15.16 7.91,15.16 v8.19,15.44 | C4.1 16.45,17.25 v16.61,17.25 | J1.1 16.21,1.43 16.21,1.44 16.21,2.07 v15.68,2.61 | +.P$1 2.15,7.25 2.15,8.37 1.8,8.72 1.8,9.55 1.93,9.68 v1.93,10.41 | v6.38,7.15 6.4,7.16 7.05,7.16 7.38,6.84 | 7.38,6.84 7.39,6.84 7.81,7.25 U1.48 8.34,7.25 8.34,4.87 R1.1 8.39,4.18 R3.1 9.3,3.52 R4.1 10.48,3.52 10.9,3.95 12.07,3.95 v12.32,4.2 | R2.1 2.17,14.42 2.94,13.65 2.94,12.96 3.83,12.07 v3.83,10.52 | v22.02,8.79 22.02,10.63 21.98,10.67 | 7.38,6.84 7.38,6.17 C2.1 6.35,5.33 6.23,5.44 v4.24,5.44 v4.22,5.43
  Bottom 0.254: v16.61,17.25 15.49,17.25 v14.46,16.22 | v14.46,16.22 14.27,16.03 14.27,16.01 13.94,15.68 8.43,15.68 v8.19,15.44 v8.18,15.44 7.88,15.14 7.88,10.48 8.21,10.15 8.21,8.5 6.89,7.17 6.43,7.17 6.4,7.15 v6.38,7.15 6.35,7.17 6.07,7.17 5.58,7.66 5.58,8.13 4.74,8.97 4.74,9.6 v3.83,10.52 3.51,10.84 2.38,10.84 1.95,10.41 v1.93,10.41 | U$2.VCC2 22.02,7.23 v22.02,8.79 | v12.36,5.71 13.11,4.97 | 13.11,4.97 14.74,3.33 14.74,3.1 15.23,2.61 v15.68,2.61 | U$2.VCC1 4.22,5.53 v4.22,5.43 | v12.32,4.2 12.34,4.2 13.11,4.97 | v14.46,16.22 14.97,15.72 15.84,15.72 16.43,15.12 16.43,11.72 v16.01,11.3
VDDCORE  (via drill 0.3)
  Top 0.254: v7.57,4.01 7.57,3.25 L1.1 7.54,2.67 C5.1 | v10.8,5.45 10.83,5.48 U1.53
  Bottom 0.254: v7.57,4.01 9.35,4.01 v10.8,5.45
VDDOUT  (via drill 0.3)
  Top 0.254: U1.55 11.83,5.51 v11.25,4.93 | L1.2 8.94,0.95 v9.06,1.07
  Bottom 0.254: v9.06,1.07 9.06,2.77 11.22,4.93 v11.25,4.93
VLCD  (via drill 0.3)
  Top 0.254: v13.74,16.23 13.65,16.23 13.33,15.92 U1.23 | C6.1 9.27,16.93 v8.55,16.21
  Bottom 0.254: v8.55,16.21 8.57,16.23 v13.74,16.23
XIN32
  Top 0.127: U1.1 18.11,7.25 19.06,6.3 X1.P$1 20.67,6.3 C7.1
XOUT32
  Top 0.127: U1.2 18.11,7.75 19.06,8.7 X1.P$2 19.87,9.14 C8.1

### Text on the board
tPlace: OSO-SWAT-A1-05 | Sensor Watch! | NOTE TO JLCPCB ENGINEER: / Please refer to order number / Y22-2862359A for correct / fabrication of the three holes / at the edge of the PCB.
bPlace: REMOVE / BAT B4 / USING / USB!!! | IMPORTANT: | BUZZ: PA27/TCC.5 / LED1: PA20/TCC.6 / LED2: PA21/TCC.7 | BTN_LIGHT: / PA22 / /I6 | BTN_ / ALARM: PA02 / /I2/RTC.IN2 | by joey castillo | except the / bear! | CC-BY-SA 4.0 | BTN_MODE: / PA23/I7 | < 9-Pin conn. | A0: PB04 / SDA: PB30/SERCOM1.0 / SCL: PB31/SERCOM1.1 / A1/SCK:PB01/TC3.1/S3.3 / A2/MOSI:PB02/TC2.0/S3.0 / A3/CS: PB03/TC2.1 / A4/MISO: PB00/ / TC3.0/S3.2 | RESET / Btn